# EAGLE design tps63020-buck-boost-flashlight-driver-test-mk-1.1.0 (EAGLE 9.2.2)
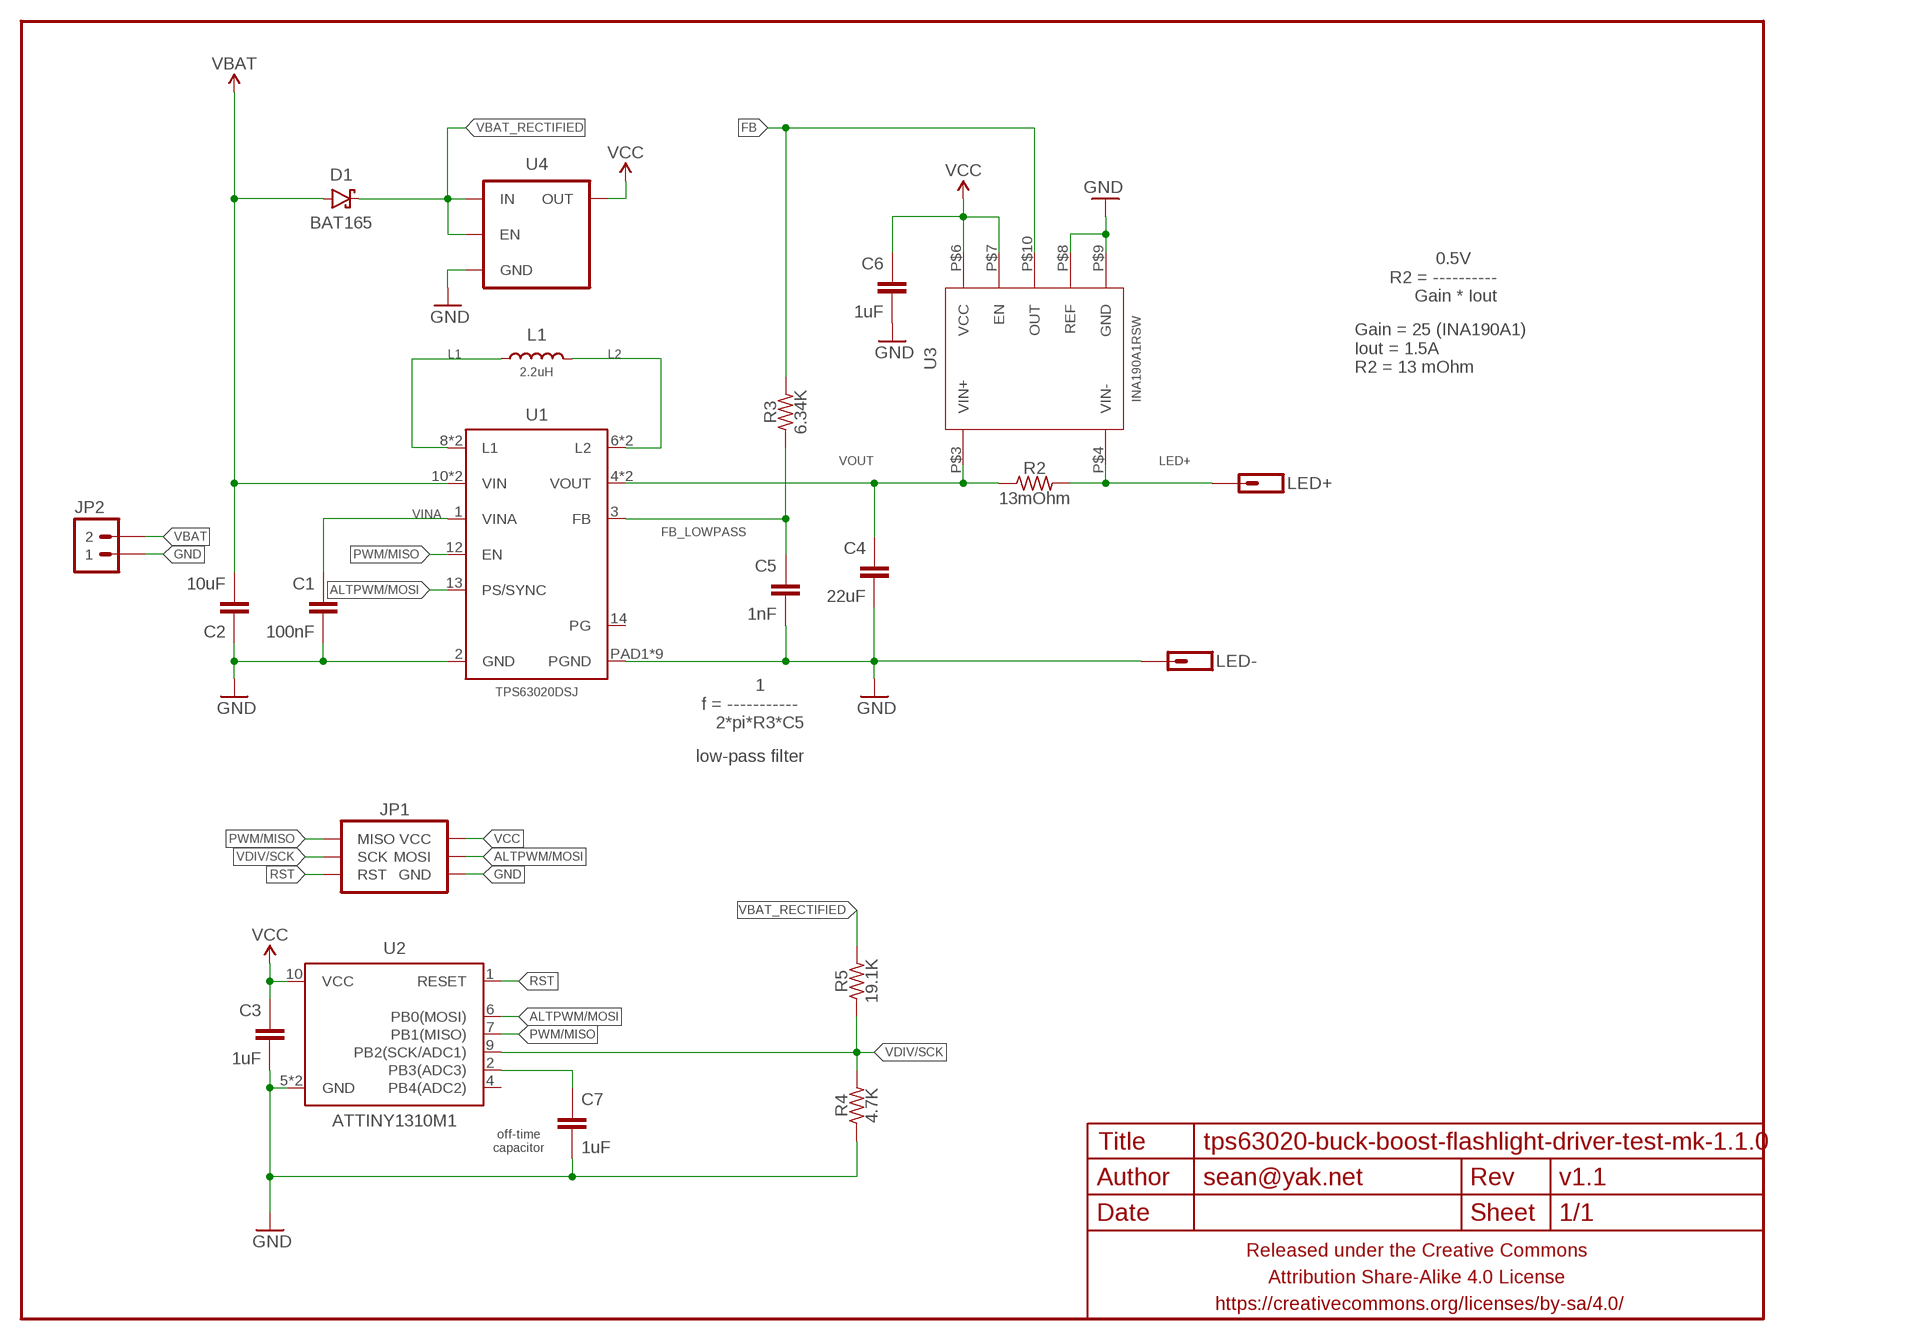
[diagram p0: schematic, sheet 1]

## Parts
C1  100nF  CAPACITOR-CERAMICC0402  [C0402]
C2  10uF  CAPACITOR-CERAMICC0805-TIGHTER  [C0805-TIGHTER]
C3  1uF  CAPACITOR-CERAMICC0402  [C0402]
C4  22uF  CAPACITOR-CERAMICC1206  [C1206]
C5  1nF  CAPACITOR-CERAMICC0402  [C0402]
C6  1uF  CAPACITOR-CERAMICC0402  [C0402]
C7  1uF  CAPACITOR-CERAMICC0402  [C0402]
D1  BAT165  DIODE-SCHOTTKYSOD323  [SOD323-SCHOTTKY]
FRAME1  FRAME-LETTERNO_PACKAGE  [DUMMY]
JP1  AVR_SPI_PRG_6PTH-1.27MM  [2X3-1.27MM-PTH]
JP2  M02PTH-2MM  [1X02-2MM-PTH]
L1  2.2uH  INDUCTORXAL50X0  [XAL50X0]
LED+  M01PTH-1MM-CIR-NS  [1X01-1MM-CIR-NS]
LED-  M01PTH-1MM-CIR-NS  [1X01-1MM-CIR-NS]
R2  13mOhm  RESISTORR1206  [R1206]
R3  6.34K  RESISTORR0402  [R0402]
R4  4.7K  RESISTORR0402  [R0402]
R5  19.1K  RESISTORR0402  [R0402]
U1  TPS63020DSJ  [VSON-14-4MMX3MM]
U2  ATTINY1310M1  [QFN10(2X5)]
U3  INA190A1RSW  INA190RSW  [UQFN-10]
U4  V_REG_ENTLV700  [SC70]

## Nets
ALTPWM/MOSI: JP1.4(MOSI) U1.13(PS/SYNC) U2.6(PB0(MOSI))
FB: R3.2 U3.P$10(OUT)
FB_LOWPASS: C5.1 R3.1 U1.3(FB)
GND: C1.2 C2.1 C3.2 C4.2 C5.2 C6.2 C7.2 JP1.6(GND) JP2.P$1 LED-.1 R4.1 U1.2(GND) U1.PAD1(PGND) U1.PAD2(PGND) U1.PAD3(PGND) U1.PAD4(PGND) U1.PAD5(PGND) U1.PAD6(PGND) U1.PAD7(PGND) U1.PAD8(PGND) U1.PADCENTER(PGND) U2.5(GND) U2.PAD(GND) U3.P$8(REF) U3.P$9(GND) U4.2(GND)
L1: L1.P$1 U1.8(L1) U1.9(L1)
L2: L1.P$2 U1.6(L2) U1.7(L2)
LED+: LED+.1 R2.2 U3.P$4(VIN-)
N$5: C7.1 U2.2(PB3(ADC3))
PWM/MISO: JP1.1(MISO) U1.12(EN) U2.7(PB1(MISO))
RST: JP1.5(RST) U2.1(RESET)
VBAT: C2.2 D1.A JP2.P$2 U1.10(VIN) U1.11(VIN)
VBAT_RECTIFIED: D1.C R5.2 U4.1(IN) U4.3(EN)
VCC: C3.1 C6.1 JP1.2(VCC) U2.10(VCC) U3.P$6(VCC) U3.P$7(EN) U4.5(OUT)
VDIV/SCK: JP1.3(SCK) R4.2 R5.1 U2.9(PB2(SCK/ADC1))
VINA: C1.1 U1.1(VINA)
VOUT: C4.1 R2.1 U1.4(VOUT) U1.5(VOUT) U3.P$3(VIN+)
Unconnected: U1.14(PG) U2.4(PB4(ADC2))

## Notes on the sheet
- 0.5V
  R2 = ----------
       Gain * Iout
- Gain = 25 (INA190A1)
  Iout = 1.5A
  R2 = 13 mOhm
- 1
  f = -----------
      2*pi*R3*C5
- low-pass filter
- off-time
  capacitor

## Library data of the parts
C1-C7 = a_parts:CAPACITOR-CERAMIC: CAPACITOR, European symbol
D1 = a_parts:DIODE-SCHOTTKY: Schottky diodes in SFE's production catalog BAT20J 1A 23V 0.62Vf RB751 120mA 40V 0.37Vf PMEG4005EJ 0.5A 40V 0.42Vf MBRA140 1A 40V 0.5Vf B340A 3A 40V SMA
FRAME1 = a_parts:FRAME-LETTER: Schematic Frame Standard 8.5x11 US Letter frame; DESIGNER: sean@yak.net; VERSION: v1.1
JP1 = a_parts:AVR_SPI_PRG_6: AVR ISP 6 Pin This is the reduced ISP connector for AVR programming. Common on Arduino. This footprint will take up less PCB space and can be used with a 10-pin to 6-pin adapter such as SKU: BOB-08508 **Special note about "TEST_POINT" package. The stop mask is on the top side, so if you want your programming test points to be on the bottom of your board, make sure to place this package on the bottom side of the board. This also ensure that the orientation to program from the bottom side will be correct.
JP2 = a_parts:M02: Standard 2-pin 0.1" header. Use with - straight break away headers ( PRT-00116) - right angle break away headers (PRT-00553) - swiss pins (PRT-00743) - machine pins (PRT-00117) - female headers (PRT-00115) Molex polarized connector foot print use with: PRT-08233 with associated crimp pins and housings. 2.54_SCREWTERM for use with PRT-10571. 3.5mm Screw Terminal footprints for PRT-08084 5mm Screw Terminal footprints for use with PRT-08433
L1 = a_parts:INDUCTOR: Inductors Basic Inductor/Choke - 0603 and 1206. Footprints are not proven and vary greatly between part numbers. SRN6045- 33uH, 20% 1.4A SDR0403-560KL - 56uH, 10%, 500mA RMS/740mA peak
LED+ LED- = a_parts:M01: Header 1 Standard 1-pin 0.1" header. Use with straight break away headers (SKU : PRT-00116), right angle break away headers (PRT-00553), swiss pins (PRT-00743), machine pins (PRT-00117), and female headers (PRT-00115).
R2-R5 = a_parts:RESISTOR: RESISTOR, American symbol
U1 = a_parts:TPS63020
U2 = a_parts:ATTINY13: Atmel 8-pin 1kB flash uC
U3 = a_parts:INA190
U4 = a_parts:V_REG_EN

## Board
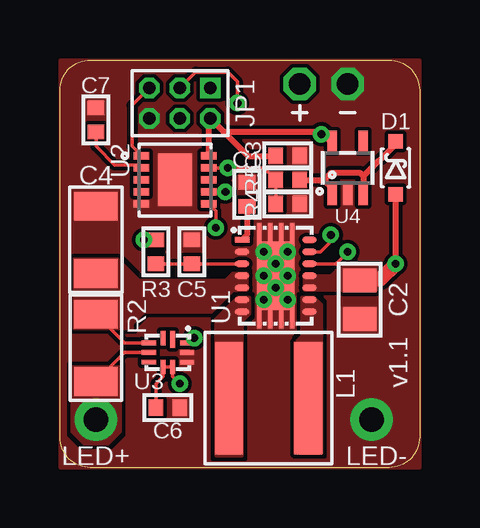
[diagram p1: board, top side]
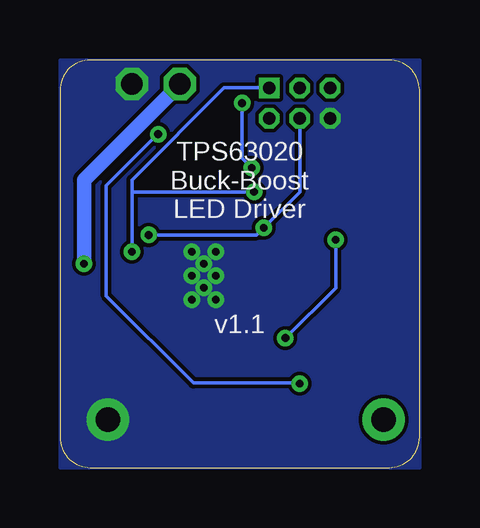
[diagram p2: board, bottom side, seen from below]

Size 15 x 17 mm. Coordinates in mm from the lower left corner, seen from the top.
Outline: 0,1.27 0,15.73 arc-90 1.27,17 13.73,17 arc-90 15,15.73 15,1.27 arc-90 13.73,0 1.27,0 arc-90 0,1.27
Copper layers (1*16): Top 0.0356mm / dielectric 1.5011mm / Bottom 0.0356mm
Design rules "LaenPCBOrder2 *": minimum track width 6mil, minimum drill 13mil, track to track 6mil, track to pad 6mil, pad to pad 6mil, via to via 6mil, smd to smd 6mil, copper to edge 0mil, drill to drill 6mil, minimum pad ring 7mil, minimum via ring 7mil, stop-mask expansion 3mil, vias tented up to drill 20mil, thermal gap 10mil

### Footprints (pad centres in the part's own frame; a part is rotated, then mirrored left to right if it is on the bottom)
C0402 = smd 0.6 x 0.7: 1 -0.5,0; 2 0.5,0
C0805-TIGHTER = smd 1 x 1.4: 1 -0.8,0; 2 0.8,0
C1206 = smd 1.2 x 1.8: 1 -1.4,0; 2 1.4,0
SOD323-SCHOTTKY = smd 0.6 x 0.6: A -1.1,0; C 1.1,0
2X3-1.27MM-PTH = drill 0.508 square: 1 -1.27,-0.635 | drill 0.508 octagon: 2 -1.27,0.635; 3 0,-0.635; 4 0,0.635; 5 1.27,-0.635; 6 1.27,0.635
1X02-2MM-PTH = drill 0.9 octagon: P$1 -1,0; P$2 1,0
XAL50X0 = smd 1.18 x 4.7: P$1 -1.651,0; P$2 1.651,0
1X01-1MM-CIR-NS = drill 1.016 pad 1.778: 1 0,0
R1206 = smd 1.2 x 1.8: 1 -1.4,0; 2 1.4,0
R0402 = smd 0.6 x 0.7: 1 -0.5,0; 2 0.5,0
VSON-14-4MMX3MM = smd 0.24 x 0.6: 1 -1.5,-1.4; 2 -1,-1.4; 3 -0.5,-1.4; 4 0,-1.4; 5 0.5,-1.4; 6 1,-1.4; 7 1.5,-1.4; 8 1.5,1.4; 9 1,1.4; 10 0.5,1.4; 11 0,1.4; 12 -0.5,1.4; 13 -1,1.4; 14 -1.5,1.4 | smd 0.775 x 0.2: PAD1 -1.812,0.69; PAD2 -1.812,0.23; PAD3 -1.812,-0.23; PAD4 -1.812,-0.69; PAD5 1.812,-0.69; PAD6 1.812,-0.23; PAD7 1.812,0.23; PAD8 1.812,0.69 | smd 2.85 x 1.58: PADCENTER 0,0
QFN10(2X5) = smd 0.65 x 0.3: 1 -1.4,1; 2 -1.4,0.5; 3 -1.4,0; 4 -1.4,-0.5; 5 -1.4,-1; 6 1.4,-1; 7 1.4,-0.5; 8 1.4,0; 9 1.4,0.5; 10 1.4,1 | smd 1.4 x 2.2: PAD 0,0
UQFN-10 = smd 0.2 x 0.7: P$1 -0.2,-0.55 | smd 0.2 x 0.6: P$2 0.2,-0.6; P$6 0.2,0.6; P$7 -0.2,0.6 | smd 0.6 x 0.2: P$3 0.8,-0.4; P$4 0.8,0; P$5 0.8,0.4; P$8 -0.8,0.4; P$9 -0.8,0; P$10 -0.8,-0.4
SC70 = smd 0.4 x 0.9: 1 -0.65,-1.1; 2 0,-1.1; 3 0.65,-1.1; 4 0.65,1.1; 5 -0.65,1.1

### Placement (x,y rotation side)
C1  7.8,11.4 90 top
C2  12.5,7 90 top
C3  9.5,13 0 top
C4  1.5,9.5 90 top
C5  5.5,9 90 top
C6  4.5,2.5 0 top
C7  1.5,14.5 90 top
D1  14,12.5 90 top
FRAME1  0,0 0 top
JP1  5,15.2 180 top
JP2  11,16 180 top
L1  8.7,2.9 180 top
LED+  1.5,2 180 top
LED-  13,2 270 top
R2  1.5,5 270 top
R3  4,9 90 top
R4  9.5,11 180 top
R5  9.5,12 0 top
U1  9,8 270 top
U2  4.8,12 0 top
U3  4.5,4.8 180 top
U4  12,12.5 0 top

### Tracks (layer width: path | path; a pad name or v marks a point on that pad's centre or on a via)
ALTPWM/MOSI  (via drill 0.33)
  Top 0.152: v6.5,10 6.5,10.7 U2.6 | v11.3,9.7 11.3,9.43 10.87,9 U1.13
  Bottom 0.152: JP1.4 5,11.5 v6.5,10 6.8,9.7 v11.3,9.7
FB  (via drill 0.33)
  Top 0.152: v3.5,9.5 R3.2 | U3.P$10 5.5,5.4 v5.6,5.4
  Bottom 0.152: v5.6,5.4 3.5,7.5 v3.5,9.5
FB_LOWPASS
  Top 0.152: R3.1 C5.1 U1.3
GND  (via drill 0.33)
  other vias: 8.5,9 9.5,9 8.5,8 9.5,8 9.5,7 8.5,7 9,7.5 9,8.5
  pour Top (rank 6, no thermals): 0,0 15,0 15,17 0,17
  pour Bottom (rank 6, no thermals): 0,0 15,0 15,17 0,17
L1
  pour Top (rank 2, no thermals): 10.1,7.1 10.6,7.1 10.9,6.8 10.9,0.6 9.9,0.6 9.9,5.3 10.1,5.5
L2
  pour Top (no thermals): 7.9,7.1 7.4,7.1 6.5,6.2 6.5,0.5 7.6,0.5 7.6,6.1 7.9,6.4
LED+
  Top 0.152: U3.P$4 2.7,4.8 R2.2
  pour Top (no thermals): 0.5,4.2 2.5,4.2 2.5,1.5 2,1 1,1 0.5,1.5
N$5
  Top 0.152: U2.2 3.28,12.62 2.28,12.62 1.5,13.4 C7.1
PWM/MISO  (via drill 0.33)
  Top 0.152: v6.9,11.5 U2.7 | v12,9 11.5,8.5 U1.12
  Bottom 0.152: JP1.1 8.16,15.84 12,12 v12,9 12,11.5 v6.9,11.5
RST
  Top 0.152: JP1.5 3,15.11 3,13.4 U2.1
VBAT  (via drill 0.33)
  Top 0.25: v14,8.5 D1.A
  Top 0.61: C2.2 13.35,7.85 v14,8.5
  Bottom 0.61: JP2.P$2 14,12 v14,8.5
  pour Top (no thermals): 10.2,8 11.3,8 11.7,8.4 13.2,8.4 13.2,7.4 10.2,7.4
VBAT_RECTIFIED
  Top 0.25: R5.2 11,12 | 11,12 11.3,12.3 12.5,12.3 12.65,12.15 | 12.65,12.15 U4.3 | U4.1 11.35,11.65 11,12 | 12.65,12.15 14,13.5 D1.C
VCC  (via drill 0.33)
  Top 0.152: C6.1 4,3.5 4.3,3.8 U3.P$6 U3.P$7 4.7,3.8 v5,3.5 | U4.5 11.21,13.6 v10.9,13.9
  Top 0.25: U4.5 10.95,14 6.83,14 | 6.83,14 JP1.2 6.2,14.49 U2.10 | 6.83,14 7.83,13 C3.1
  Bottom 0.152: v5,3.5 5.03,3.53 9.44,3.53 13.07,7.16 13.07,11.76 10.93,13.9 v10.9,13.9
VDIV/SCK  (via drill 0.33)
  Top 0.152: U2.9 v7,12.5 8.5,12.5 R5.1 R4.2 | v7.4,15.2 7.4,16.1 7,16.5 5.66,16.5 JP1.3
  Bottom 0.152: v7.4,15.2 7.4,12.9 v7,12.5
VINA
  Top 0.25: C1.1 7.8,9.7 U1.1
VOUT
  Top 0.152: U3.P$3 2.7,5.2 R2.1
  pour Top (rank 2, no thermals): 7.8,8.1 7.2,8.1 6.9,7.8 3.3,7.8 2.4,8.7 0.6,8.7 0.6,5.8 3,5.8 3,6 3.5,6.5 6.5,6.5 7.4,7.4 7.8,7.4

### Text on the board
bPlace: TPS63020 / Buck-Boost / LED Driver